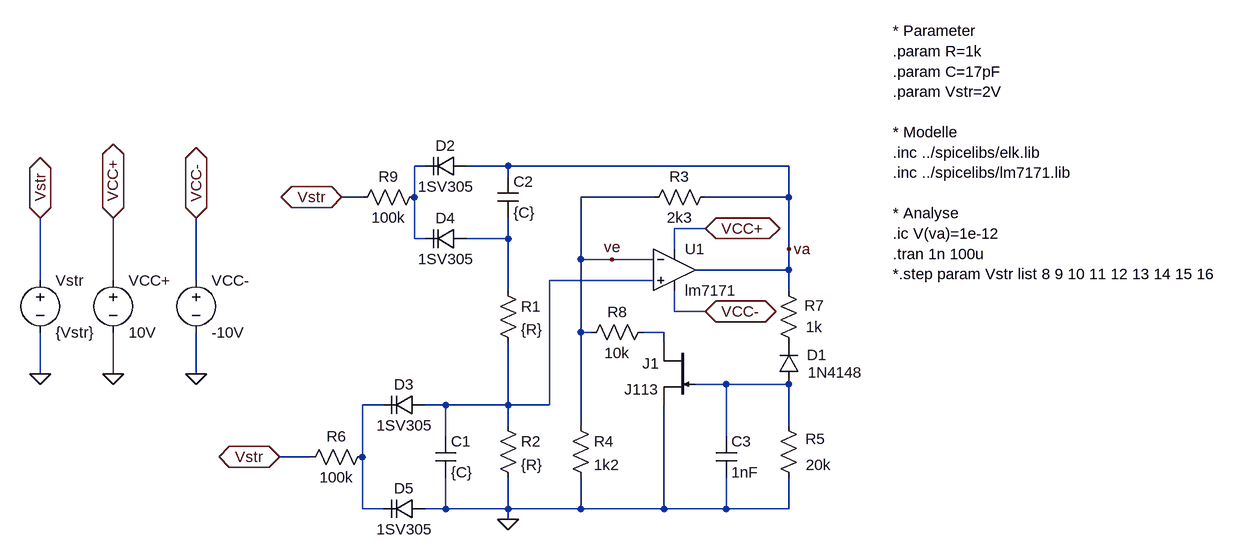
[diagram p0: schematic Wien-LT_MM.asc]
Wien-LT_MM.asc, the LTspice schematic file:
Version 4.1
SHEET 1 1468 680
WIRE 64 -2704 48 -2704
WIRE 192 -2704 128 -2704
WIRE 624 -2704 192 -2704
WIRE 192 -2688 192 -2704
WIRE -32 -2656 -64 -2656
WIRE 48 -2656 48 -2704
WIRE 416 -2656 304 -2656
WIRE 624 -2656 624 -2704
WIRE 624 -2656 496 -2656
WIRE 496 -2608 448 -2608
WIRE 48 -2592 48 -2656
WIRE 64 -2592 48 -2592
WIRE 192 -2592 192 -2624
WIRE 192 -2592 128 -2592
WIRE 448 -2576 448 -2608
WIRE 624 -2576 624 -2656
WIRE 304 -2560 304 -2656
WIRE 352 -2560 304 -2560
WIRE 416 -2560 352 -2560
WIRE 624 -2544 624 -2576
WIRE 624 -2544 480 -2544
WIRE -528 -2528 -528 -2624
WIRE -416 -2528 -416 -2624
WIRE -288 -2528 -288 -2624
WIRE 416 -2528 256 -2528
WIRE 192 -2512 192 -2592
WIRE 624 -2512 624 -2544
WIRE 448 -2480 448 -2512
WIRE 496 -2480 448 -2480
WIRE 304 -2448 304 -2560
WIRE 320 -2448 304 -2448
WIRE 432 -2448 400 -2448
WIRE 432 -2432 432 -2448
WIRE -528 -2384 -528 -2448
WIRE -416 -2384 -416 -2448
WIRE -288 -2384 -288 -2448
WIRE 528 -2368 480 -2368
WIRE 624 -2368 528 -2368
WIRE 0 -2336 -32 -2336
WIRE 96 -2336 64 -2336
WIRE 192 -2336 192 -2432
WIRE 192 -2336 96 -2336
WIRE 256 -2336 256 -2528
WIRE 256 -2336 192 -2336
WIRE 192 -2304 192 -2336
WIRE 304 -2304 304 -2448
WIRE 624 -2304 624 -2368
WIRE 96 -2288 96 -2336
WIRE 528 -2288 528 -2368
WIRE -112 -2256 -160 -2256
WIRE -32 -2256 -32 -2336
WIRE -32 -2176 -32 -2256
WIRE 0 -2176 -32 -2176
WIRE 96 -2176 96 -2224
WIRE 96 -2176 64 -2176
WIRE 192 -2176 192 -2224
WIRE 192 -2176 96 -2176
WIRE 304 -2176 304 -2224
WIRE 304 -2176 192 -2176
WIRE 432 -2176 432 -2336
WIRE 432 -2176 304 -2176
WIRE 528 -2176 528 -2224
WIRE 528 -2176 432 -2176
WIRE 624 -2176 624 -2224
WIRE 624 -2176 528 -2176
WIRE 192 -2160 192 -2176
FLAG 192 -2160 0
FLAG -416 -2624 VCC+
IOPIN -416 -2624 BiDir
FLAG -288 -2624 VCC-
IOPIN -288 -2624 BiDir
FLAG 496 -2608 VCC+
IOPIN 496 -2608 BiDir
FLAG 496 -2480 VCC-
IOPIN 496 -2480 BiDir
FLAG -288 -2384 0
FLAG -416 -2384 0
FLAG -528 -2384 0
FLAG -64 -2656 Vstr
IOPIN -64 -2656 BiDir
FLAG -160 -2256 Vstr
IOPIN -160 -2256 BiDir
FLAG -528 -2624 Vstr
IOPIN -528 -2624 BiDir
FLAG 352 -2560 ve
FLAG 624 -2576 va
SYMBOL cap 80 -2288 R0
SYMATTR InstName C1
SYMATTR Value {C}
SYMBOL cap 176 -2688 R0
SYMATTR InstName C2
SYMATTR Value {C}
SYMBOL res 176 -2320 R0
SYMATTR InstName R2
SYMATTR Value {R}
SYMBOL res 288 -2320 R0
SYMATTR InstName R4
SYMATTR Value 1k2
SYMBOL res 416 -2464 R90
WINDOW 0 0 56 VBottom 2
WINDOW 3 32 56 VTop 2
SYMATTR InstName R8
SYMATTR Value 10k
SYMBOL res 640 -2208 R180
WINDOW 0 -40 76 Left 2
WINDOW 3 -49 36 Left 2
SYMATTR InstName R5
SYMATTR Value 20k
SYMBOL res 640 -2416 R180
WINDOW 0 -39 73 Left 2
WINDOW 3 -36 40 Left 2
SYMATTR InstName R7
SYMATTR Value 1k
SYMBOL res 400 -2640 R270
WINDOW 0 32 56 VTop 2
WINDOW 3 0 56 VBottom 2
SYMATTR InstName R3
SYMATTR Value 2k3
SYMBOL res 176 -2528 R0
SYMATTR InstName R1
SYMATTR Value {R}
SYMBOL res 64 -2672 R90
WINDOW 0 0 56 VBottom 2
WINDOW 3 32 56 VTop 2
SYMATTR InstName R9
SYMATTR Value 100k
SYMBOL res -16 -2272 R90
WINDOW 0 0 56 VBottom 2
WINDOW 3 32 56 VTop 2
SYMATTR InstName R6
SYMATTR Value 100k
SYMBOL diode 640 -2368 R180
WINDOW 0 -43 45 Left 2
WINDOW 3 -98 18 Left 2
SYMATTR InstName D1
SYMATTR Value 1N4148
SYMBOL cap 512 -2288 R0
SYMATTR InstName C3
SYMATTR Value 1nF
SYMBOL voltage -288 -2544 R0
SYMATTR InstName VCC-
SYMATTR Value -10V
SYMBOL voltage -416 -2544 R0
SYMATTR InstName VCC+
SYMATTR Value 10V
SYMBOL voltage -528 -2544 R0
SYMATTR InstName Vstr
SYMATTR Value {Vstr}
SYMBOL OpAmps\\opamp2 448 -2608 R0
SYMATTR InstName U1
SYMATTR Value lm7171
SYMBOL varactor 128 -2720 R90
WINDOW 0 0 32 VBottom 2
WINDOW 3 32 32 VTop 2
SYMATTR InstName D2
SYMATTR Value 1SV305
SYMBOL varactor 64 -2352 R90
WINDOW 0 0 32 VBottom 2
WINDOW 3 32 32 VTop 2
SYMATTR InstName D3
SYMATTR Value 1SV305
SYMBOL varactor 128 -2608 R90
WINDOW 0 0 32 VBottom 2
WINDOW 3 32 32 VTop 2
SYMATTR InstName D4
SYMATTR Value 1SV305
SYMBOL varactor 64 -2192 R90
WINDOW 0 0 32 VBottom 2
WINDOW 3 32 32 VTop 2
SYMATTR InstName D5
SYMATTR Value 1SV305
SYMBOL njf 480 -2432 M0
SYMATTR InstName J1
SYMATTR Value J113
TEXT 784 -2912 Left 2 !* Parameter\n.param R=1k\n.param C=17pF\n.param Vstr=2V\n \n* Modelle \n.inc ../spicelibs/elk.lib\n.inc ../spicelibs/lm7171.lib\n \n* Analyse\n.ic V(va)=1e-12\n.tran 1n 100u\n*.step param Vstr list 8 9 10 11 12 13 14 15 16

The netlist it stands for:
* Wien-LT_MM.asc
C1 N003 0 {C}
C2 va N002 {C}
R2 N003 0 {R}
R4 ve 0 1k2
R8 N004 ve 10k
R5 0 N005 20k
R7 P001 va 1k
R3 ve va 2k3
R1 N002 N003 {R}
R9 N001 Vstr 100k
R6 N006 Vstr 100k
D1 N005 P001 1N4148
C3 N005 0 1nF
VCC- VCC- 0 -10V
VCC+ VCC+ 0 10V
Vstr Vstr 0 {Vstr}
X§U1 N003 ve VCC+ VCC- va lm7171  ; pins In+ In- V+ V- OUT
D2 va N001 1SV305
D3 N003 N006 1SV305
D4 N002 N001 1SV305
D5 0 N006 1SV305
J1 N004 N005 0 J113
.model D D
.lib standard.dio
.model NJF NJF
.model PJF PJF
.lib standard.jft
* Parameter
.param R=1k
.param C=17pF
.param Vstr=2V
* Modelle
.inc ../spicelibs/elk.lib
.inc ../spicelibs/lm7171.lib
* Analyse
.ic V(va)=1e-12
.tran 1n 100u
*.step param Vstr list 8 9 10 11 12 13 14 15 16
.backanno
.end